# Altium schematic sheet led.SchDoc
size 292 x 204 mm; ProjectSection: Set ProjectSection in Document Parameters; PageSetup: Record=PageOptions|CenterHorizontal=True|CenterVertical=True|PrintScale=1.00|XCorrection=1.00|YCorrection=1.00|PrintKind=1|BorderSize=5000000|LeftOffset=0|BottomOffset=0|Orientation=2|PaperLength=1000|PaperWidth=1000|Scale=100|PaperSource=7|PrintQuality=1200|MediaType=1|DitherType=10|PaperKind=A4|PrintScaleMode=1
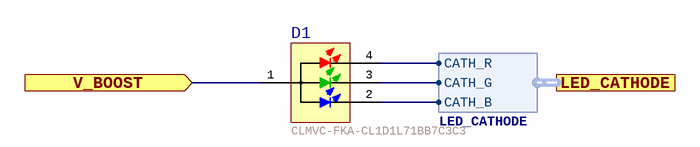
[diagram p0: led.SchDoc]

## Parts
D1  Manufacturer P/N: CLMVC-FKA-CL1D1L71BB7C3C3  [LED-RGB-PLCC4-2020-CLMVx-FKA]  (hidden comment: DIO-LED-RGB-CA-PIN1-CLMVx-FKA)

## Ports
LED_CATHODE (harness LED_CATHODE), V_BOOST (in)

## Harnesses
LED_CATHODE: CATH_R, CATH_B, CATH_G

## Nets
V_BOOST: D1.1(Anode) ; port V_BOOST
NetD1_2: D1.2(B) ; port LED_CATHODE.CATH_B
NetD1_3: D1.3(G) ; port LED_CATHODE.CATH_G
NetD1_4: D1.4(R) ; port LED_CATHODE.CATH_R

## Notes on the sheet
- Project
- Customer
- File Name
- Part
- Section
- Revision (File)
- Variant
- Revision (Project)
- Date
- Sheet
- Contronix GmbH
- Nizzastr. 6, 01445 Radebeul

## Library data of the parts
D1 = LED-RGB-CLMVC-FKA-PLCC4: RGB LED PLCC-4 2x2mm Common Anode; Manufacturer: Cree Inc; hasAltManufacturer: 0; Contronix P/N: DR7TDL; NozzleType: 711/911; FeederType: Tape 8mm; FeederPitch: 4mm; NumberOfPins: 4; NumberOfRows: 2; Design Item Id: LED-RGB-CLMVC-FKA-PLCC4; Stock: 15; Price: 0,17; Price (€): 0,17; ComponentLink1Description: Manufacturer Datasheet; ComponentLink1URL: https://www.cree.com/led-components/media/documents/1273-CLMVC-FKA.pdf; Supplier 1: Digi-Key; Supplier Part Number 1: CLMVC-FKA-CL1D1L71BB7C3C3CT-ND; Supplier 2: Mouser; Supplier Part Number 2: 941-CLMVCFKACL1D1L71; Created: 21.03.2018 20:33:27; Modified: 30.06.2020 13:58:57; Obsolete: 0; Color: RGB; isMulticolor: 0; MountingType: SMT; Manufacturer Part Number: CLMVC-FKA-CL1D1L71BB7C3C3